# EAGLE design EYRCFINAL (EAGLE 9.6.2)
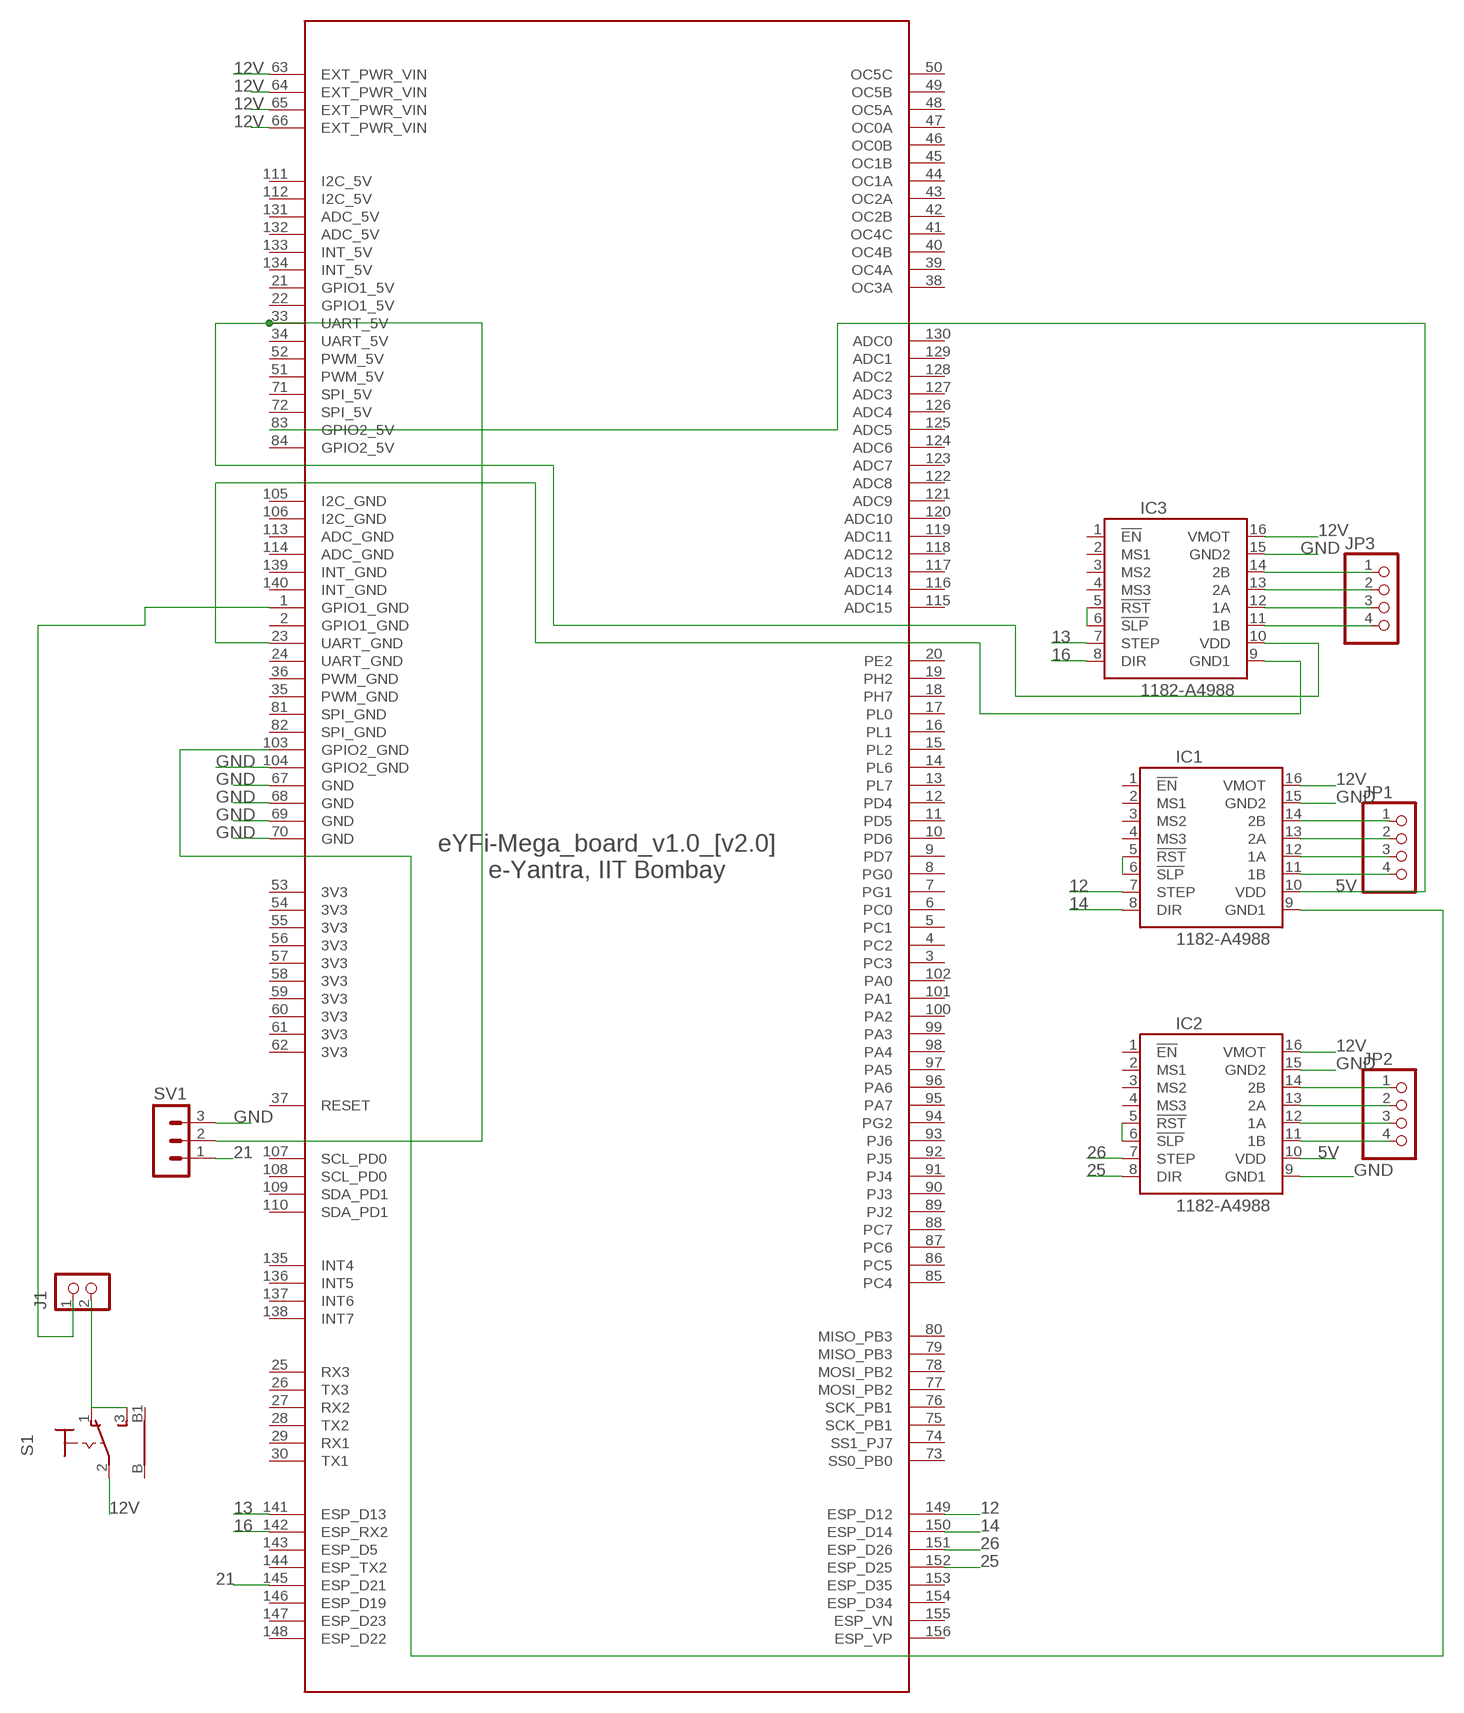
[diagram p0: schematic, sheet 1]

## Parts
IC1  1182-A4988  [A4988]
IC2  1182-A4988  [A4988]
IC3  1182-A4988  [A4988]
J1  CON_TERMINAL_BLOCK_02-5MM  [TERMINAL_BLOCK_2P_5]
JP1  PINHD-1X4  [1X04]
JP2  PINHD-1X4  [1X04]
JP3  PINHD-1X4  [1X04]
S1  9070-1W  [9070-1W]
SV1  MA03-1  [MA03-1]
U$1  EYFI-MEGA_V2.0  [EYFI-MEGA_V2.0]

## Nets
5V: IC1.10(VDD) IC2.10(VDD) U$1.83(GPIO2_5V)
12: IC1.7(STEP) U$1.149(ESP_D12)
12V: IC1.16(VMOT) IC2.16(VMOT) IC3.16(VMOT) S1.2(P) U$1.63(EXT_PWR_VIN) U$1.64(EXT_PWR_VIN) U$1.65(EXT_PWR_VIN) U$1.66(EXT_PWR_VIN)
13: IC3.7(STEP) U$1.141(ESP_D13)
14: IC1.8(DIR) U$1.150(ESP_D14)
16: IC3.8(DIR) U$1.142(ESP_RX2)
21: SV1.1 U$1.145(ESP_D21)
25: IC2.8(DIR) U$1.152(ESP_D25)
26: IC2.7(STEP) U$1.151(ESP_D26)
GND: IC1.9(GND1) IC1.15(GND2) IC2.9(GND1) IC2.15(GND2) IC3.9(GND1) IC3.15(GND2) SV1.3 U$1.23(UART_GND) U$1.67(GND) U$1.68(GND) U$1.69(GND) U$1.70(GND) U$1.103(GPIO2_GND) U$1.104(GPIO2_GND)
N$1: IC1.14(2B) JP1.1
N$2: IC1.13(2A) JP1.2
N$3: IC1.12(1A) JP1.3
N$4: IC1.11(1B) JP1.4
N$5: IC2.14(2B) JP2.1
N$6: IC2.13(2A) JP2.2
N$7: IC2.12(1A) JP2.3
N$8: IC2.11(1B) JP2.4
N$9: IC3.14(2B) JP3.1
N$10: IC3.13(2A) JP3.2
N$11: IC3.12(1A) JP3.3
N$12: IC3.11(1B) JP3.4
N$13: J1.1 U$1.1(GPIO1_GND)
N$14: IC3.10(VDD) SV1.2 U$1.33(UART_5V)
N$15: J1.2 S1.1(O) S1.3(S)
N$16: IC3.5(!RST) IC3.6(!SLP)
N$17: IC1.5(!RST) IC1.6(!SLP)
N$18: IC2.5(!RST) IC2.6(!SLP)
Unconnected: IC1.1(!EN) IC1.2(MS1) IC1.3(MS2) IC1.4(MS3) IC2.1(!EN) IC2.2(MS1) IC2.3(MS2) IC2.4(MS3) IC3.1(!EN) IC3.2(MS1) IC3.3(MS2) IC3.4(MS3) S1.B S1.B1 U$1.3(PC3) U$1.4(PC2) U$1.5(PC1) U$1.6(PC0) U$1.7(PG1) U$1.8(PG0) U$1.9(PD7) U$1.10(PD6) U$1.11(PD5) U$1.12(PD4) U$1.13(PL7) U$1.14(PL6) U$1.15(PL2) U$1.16(PL1) U$1.17(PL0) U$1.18(PH7) U$1.19(PH2) U$1.20(PE2) U$1.25(RX3) U$1.26(TX3) U$1.27(RX2) U$1.28(TX2) U$1.29(RX1) U$1.30(TX1) U$1.37(RESET) U$1.38(OC3A) U$1.39(OC4A) U$1.40(OC4B) U$1.41(OC4C) U$1.42(OC2B) U$1.43(OC2A) U$1.44(OC1A) U$1.45(OC1B) U$1.46(OC0B) U$1.47(OC0A) U$1.48(OC5A) U$1.49(OC5B) U$1.50(OC5C) U$1.73(SS0_PB0) U$1.74(SS1_PJ7) U$1.75(SCK_PB1) U$1.76(SCK_PB1) U$1.77(MOSI_PB2) U$1.78(MOSI_PB2) U$1.79(MISO_PB3) U$1.80(MISO_PB3) U$1.85(PC4) U$1.86(PC5) U$1.87(PC6) U$1.88(PC7) U$1.89(PJ2) U$1.90(PJ3) U$1.91(PJ4) U$1.92(PJ5) U$1.93(PJ6) U$1.94(PG2) U$1.95(PA7) U$1.96(PA6) U$1.97(PA5) U$1.98(PA4) U$1.99(PA3) U$1.100(PA2) U$1.101(PA1) U$1.102(PA0) U$1.107(SCL_PD0) U$1.108(SCL_PD0) U$1.109(SDA_PD1) U$1.110(SDA_PD1) U$1.115(ADC15) U$1.116(ADC14) U$1.117(ADC13) U$1.118(ADC12) U$1.119(ADC11) U$1.120(ADC10) U$1.121(ADC9) U$1.122(ADC8) U$1.123(ADC7) U$1.124(ADC6) U$1.125(ADC5) U$1.126(ADC4) U$1.127(ADC3) U$1.128(ADC2) U$1.129(ADC1) U$1.130(ADC0) U$1.135(INT4) U$1.136(INT5) U$1.137(INT6) U$1.138(INT7) U$1.143(ESP_D5) U$1.144(ESP_TX2) U$1.146(ESP_D19) U$1.147(ESP_D23) U$1.148(ESP_D22) U$1.153(ESP_D35) U$1.154(ESP_D34) U$1.155(ESP_VN) U$1.156(ESP_VP)

## Power pins joined to a net without a drawn wire
3V3: U$1.53(3V3) U$1.54(3V3) U$1.55(3V3) U$1.56(3V3) U$1.57(3V3) U$1.58(3V3) U$1.59(3V3) U$1.60(3V3) U$1.61(3V3) U$1.62(3V3)
ADC_5V: U$1.131(ADC_5V) U$1.132(ADC_5V)
ADC_GND: U$1.113(ADC_GND) U$1.114(ADC_GND)
GPIO1_5V: U$1.21(GPIO1_5V) U$1.22(GPIO1_5V)
GPIO1_GND: U$1.2(GPIO1_GND)
GPIO2_5V: U$1.84(GPIO2_5V)
I2C_5V: U$1.111(I2C_5V) U$1.112(I2C_5V)
I2C_GND: U$1.105(I2C_GND) U$1.106(I2C_GND)
INT_5V: U$1.133(INT_5V) U$1.134(INT_5V)
INT_GND: U$1.139(INT_GND) U$1.140(INT_GND)
PWM_5V: U$1.51(PWM_5V) U$1.52(PWM_5V)
PWM_GND: U$1.35(PWM_GND) U$1.36(PWM_GND)
SPI_5V: U$1.71(SPI_5V) U$1.72(SPI_5V)
SPI_GND: U$1.81(SPI_GND) U$1.82(SPI_GND)
UART_5V: U$1.34(UART_5V)
UART_GND: U$1.24(UART_GND)

## Library data of the parts
IC1-IC3 = pololu-stepper-driver:1182-A4988: A4988 Stepper Motor Driver Carrier #1182 A4988 Stepper Motor Driver Carrier <https://www.pololu.com/product/1182> in Japan, Suzaku Lab. Ltd. <https://suzakugiken.jp/> #1182 A4988ステッピングモータドライバ <https://szc.jp/po1182>
J1 = dp_devices.v6:CON_TERMINAL_BLOCK_02: 2 poles wire to board terminal block
JP1-JP3 = pinhead:PINHD-1X4: PIN HEADER
S1 = switch:9070-1W: TOGGLE SWITCH Marquardt
SV1 = con-lstb:MA03-1: PIN HEADER; OC_FARNELL: unknown; OC_NEWARK: unknown
U$1 = eYFi-Mega_board_v1.0:EYFI-MEGA_V2.0

## Board
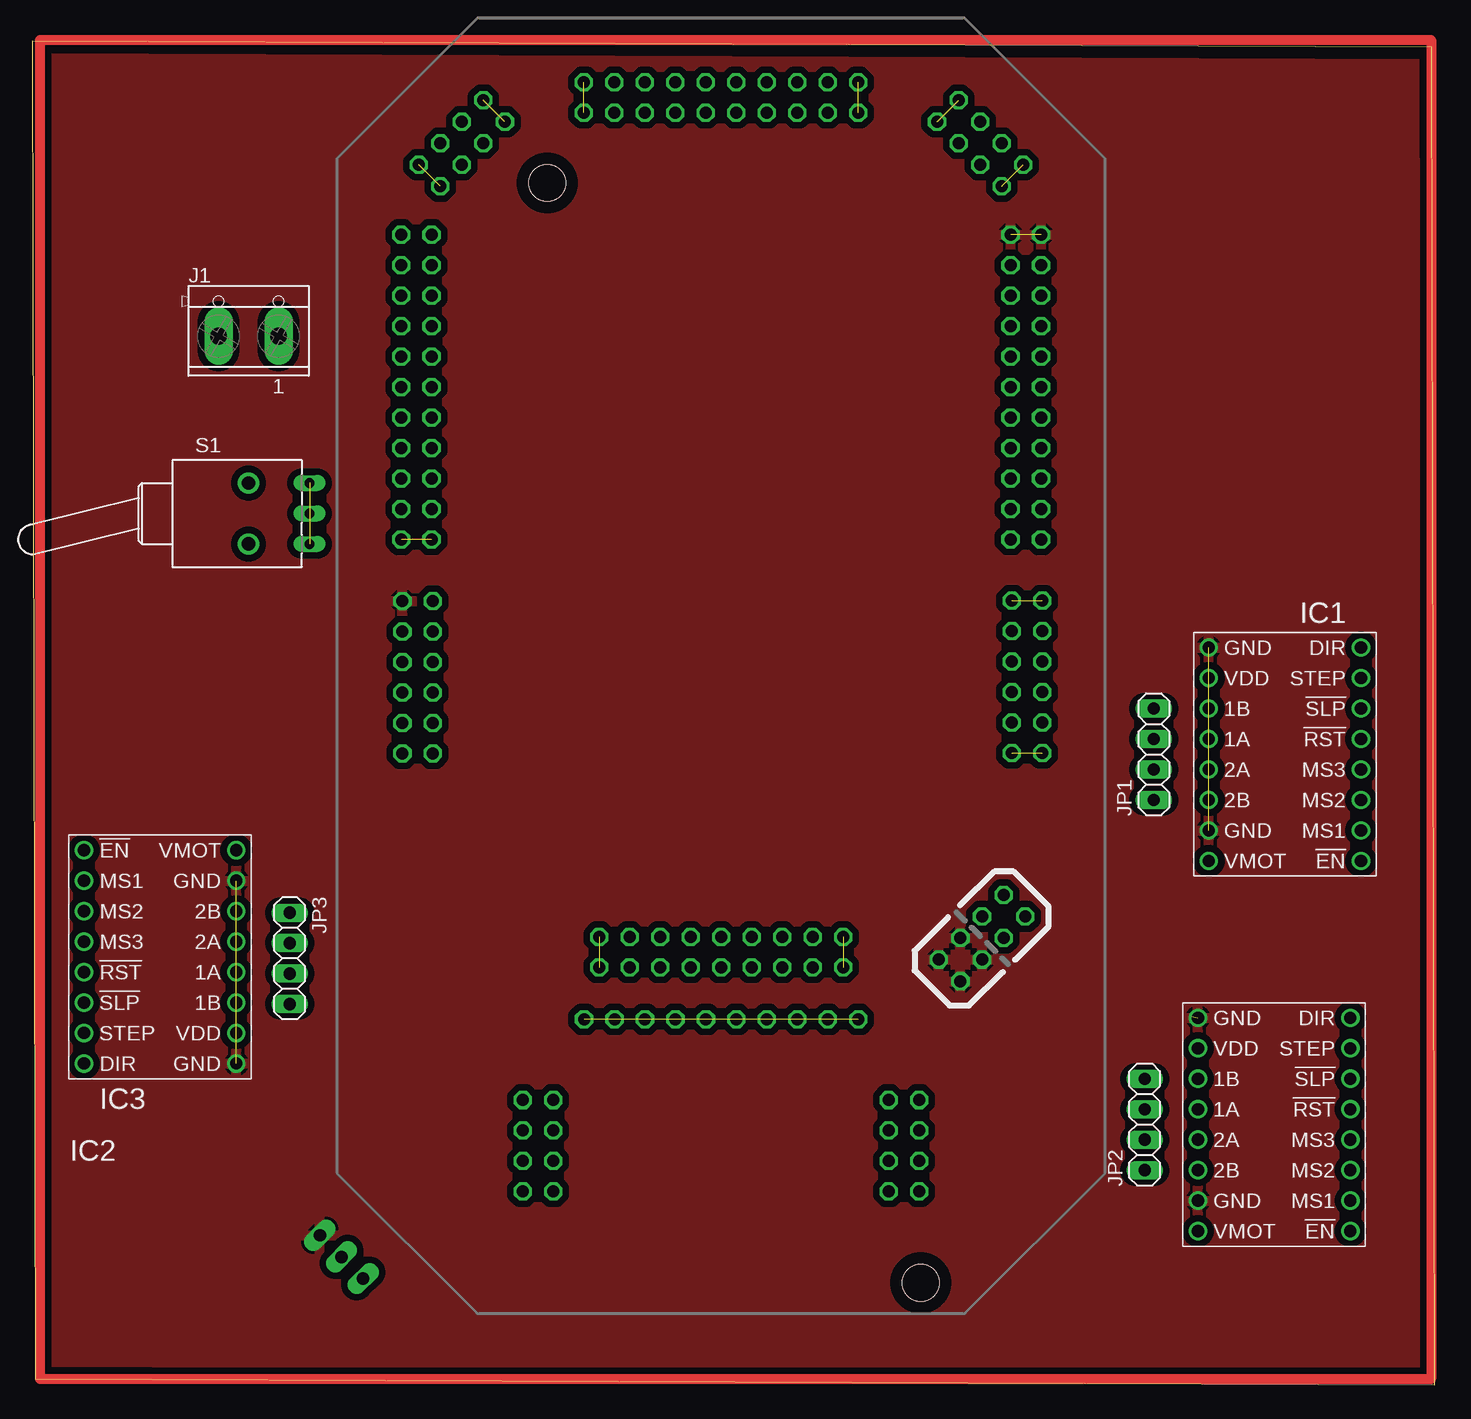
[diagram p1: board, top side]
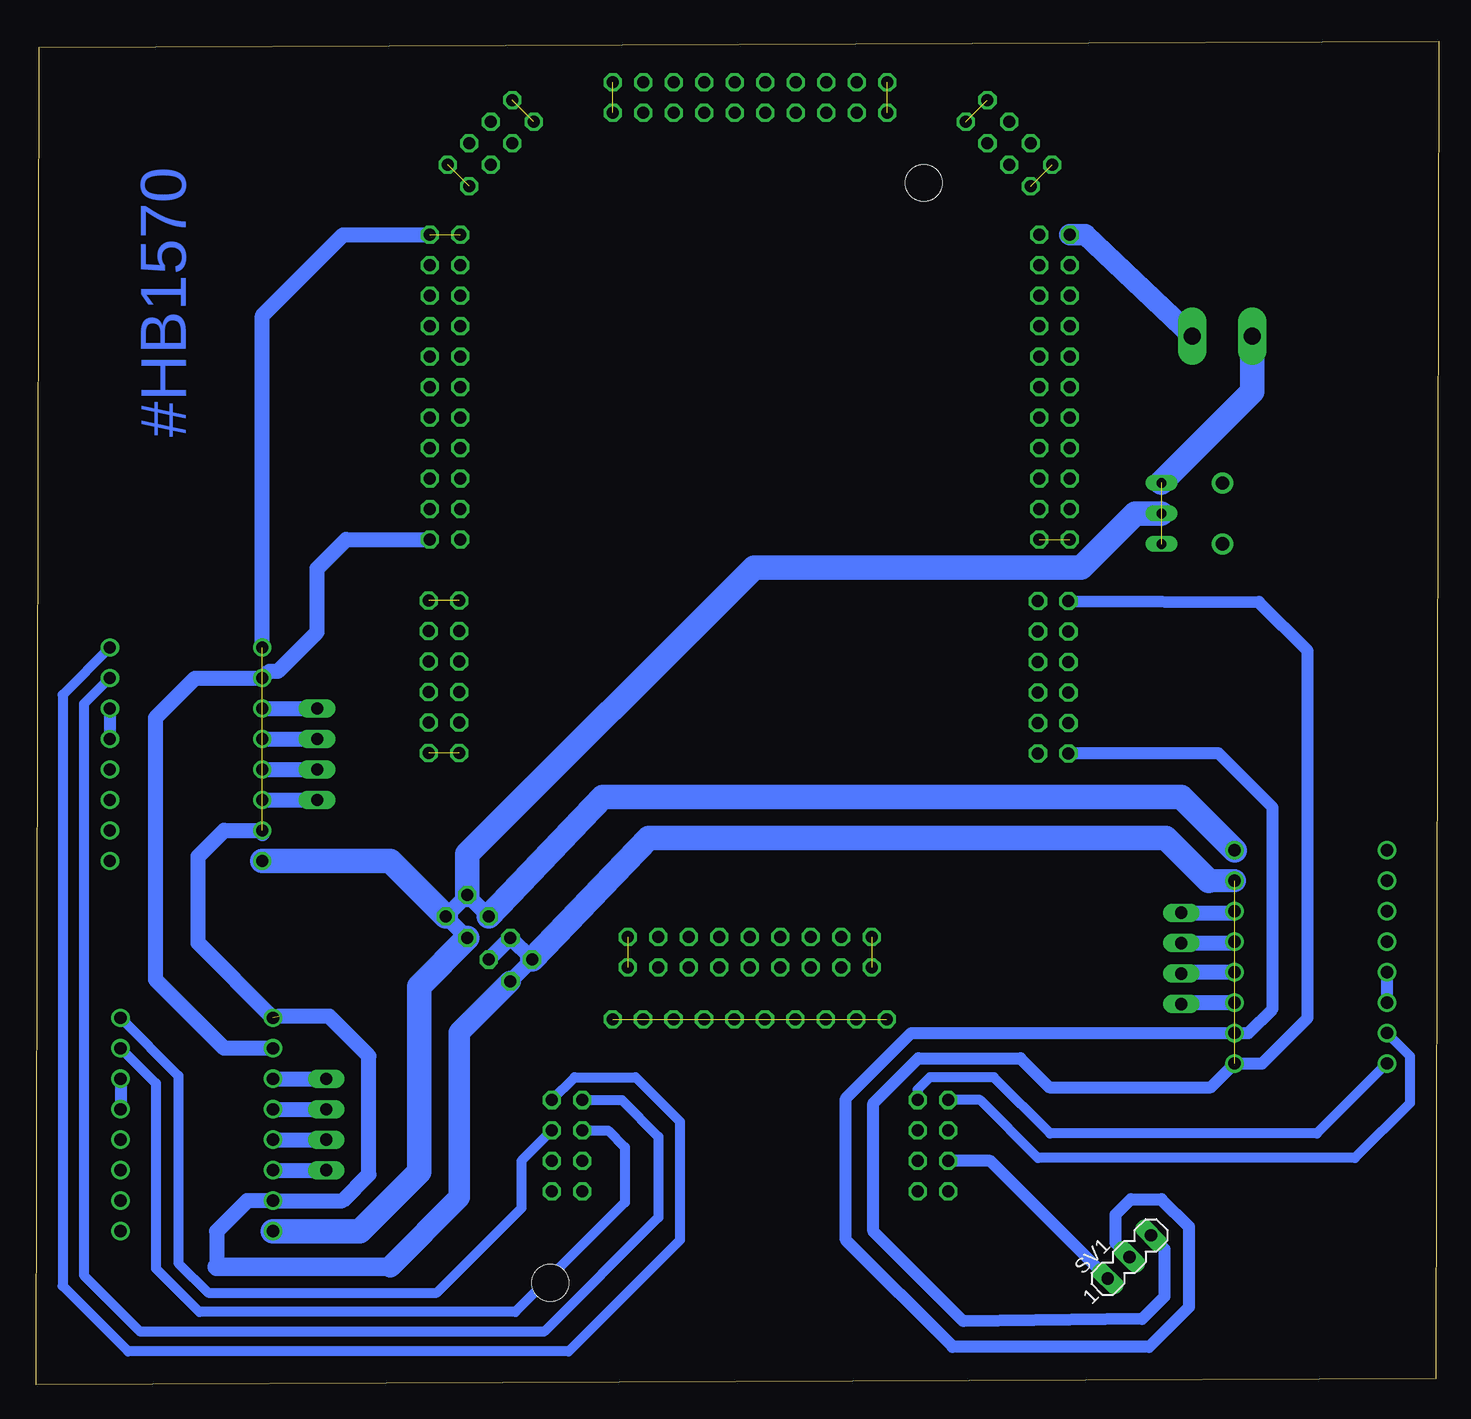
[diagram p2: board, bottom side, seen from below]

Size 116.89 x 112 mm. Coordinates in mm from the lower left corner, seen from the top.
Outline: 0.25,0.51 116.89,0 116.64,111.5 0,112 0.25,0.51
Copper layers (1*16): Top 0.035mm / dielectric 1.5mm / Bottom 0.035mm
Design rules "default *": minimum track width 6mil, minimum drill 0.35mm, track to track 22mil, track to pad 22mil, pad to pad 22mil, via to via 22mil, smd to smd 22mil, copper to edge 40mil, drill to drill 6mil, minimum pad ring 10mil, minimum via ring 8mil, stop-mask expansion 4mil, vias tented up to drill 0mil, thermal gap 10mil

### Footprints (pad centres in the part's own frame; a part is rotated, then mirrored left to right if it is on the bottom)
A4988 = drill 1.016: 1 -6.35,8.89; 2 -6.35,6.35; 3 -6.35,3.81; 4 -6.35,1.27; 5 -6.35,-1.27; 6 -6.35,-3.81; 7 -6.35,-6.35; 8 -6.35,-8.89; 9 6.35,-8.89; 10 6.35,-6.35; 11 6.35,-3.81; 12 6.35,-1.27; 13 6.35,1.27; 14 6.35,3.81; 15 6.35,6.35; 16 6.35,8.89
TERMINAL_BLOCK_2P_5 = drill 1.4 pad 2.38 long: 1 2.5,-0.45; 2 -2.5,-0.45
1X04 = drill 1.016 long: 1 -3.81,0; 2 -1.27,0; 3 1.27,0; 4 3.81,0
9070-1W = drill 0.813 long: 1 5.08,-2.54; 2 5.08,0; 3 5.08,2.54 | drill 1.118 pad 1.778: B 0,-2.54; B1 0,2.54
MA03-1 = drill 1.016 long: 1 -2.54,0; 2 0,0; 3 2.54,0
EYFI-MEGA_V2.0 = drill 1 octagon: 1 -26.66,35.941; 2 -24.12,35.941; 3 -26.66,33.401; 4 -24.12,33.401; 5 -26.66,30.861; 6 -24.12,30.861; 7 -26.66,28.321; 8 -24.12,28.321; 9 -26.66,25.781; 10 -24.12,25.781; 11 -26.66,23.241; 12 -24.12,23.241; 13 -26.66,20.701; 14 -24.12,20.701; 15 -26.66,18.161; 16 -24.12,18.161; 17 -26.66,15.621; 18 -24.12,15.621; 19 -26.66,13.081; 20 -24.12,13.081; 21 -26.66,10.541; 22 -24.12,10.541; 23 -26.543,5.397; 24 -24.003,5.397; 25 -26.543,2.857; 26 -24.003,2.857; 27 -26.543,0.318; 28 -24.003,0.318; 29 -26.543,-2.223; 30 -24.003,-2.223; 31 -26.543,-4.763; 32 -24.003,-4.763; 33 -26.543,-7.303; 34 -24.003,-7.303; 35 -10.147,-25.136; 36 -10.147,-22.596; 37 -7.607,-25.136; 38 -7.607,-22.596; 39 -5.067,-25.136; 40 -5.067,-22.596; 41 -2.527,-25.136; 42 -2.527,-22.596; 43 0.013,-25.136; 44 0.013,-22.596; 45 2.553,-25.136; 46 2.553,-22.596; 47 5.093,-25.136; 48 5.093,-22.596; 49 7.633,-25.136; 50 7.633,-22.596; 51 10.173,-25.136; 52 10.173,-22.596; 53 -11.412,-29.464; 54 -8.872,-29.464; 55 -6.332,-29.464; 56 -3.792,-29.464; 57 -1.252,-29.464; 58 1.288,-29.464; 59 3.828,-29.464; 60 6.368,-29.464; 61 8.908,-29.464; 62 11.448,-29.464; 63 25.344,-20.897; 64 23.548,-19.101; 65 23.548,-22.693; 66 21.752,-20.897; 67 21.752,-24.489; 68 19.956,-22.693; 69 19.956,-26.285; 70 18.16,-24.489; 71 26.779,-7.264; 72 24.239,-7.264; 73 26.779,-4.724; 74 24.239,-4.724; 75 26.779,-2.184; 76 24.239,-2.184; 77 26.779,0.356; 78 24.239,0.356; 79 26.779,2.896; 80 24.239,2.896; 81 26.779,5.436; 82 24.239,5.436; 83 26.67,10.541; 84 24.13,10.541; 85 26.67,13.081; 86 24.13,13.081; 87 26.67,15.621; 88 24.13,15.621; 89 26.67,18.161; 90 24.13,18.161; 91 26.67,20.701; 92 24.13,20.701; 93 26.67,23.241; 94 24.13,23.241; 95 26.67,25.781; 96 24.13,25.781; 97 26.67,28.321; 98 24.13,28.321; 99 26.67,30.861; 100 24.13,30.861; 101 26.67,33.401; 102 24.13,33.401; 103 26.67,35.941; 104 24.13,35.941; 105 25.188,41.771; 106 23.392,39.975; 107 23.392,43.567; 108 21.596,41.771; 109 21.596,45.363; 110 19.8,43.567; 111 19.8,47.16; 112 18.004,45.363; 113 11.43,48.641; 114 11.43,46.101; 115 8.89,48.641; 116 8.89,46.101; 117 6.35,48.641; 118 6.35,46.101; 119 3.81,48.641; 120 3.81,46.101; 121 1.27,48.641; 122 1.27,46.101; 123 -1.27,48.641; 124 -1.27,46.101; 125 -3.81,48.641; 126 -3.81,46.101; 127 -6.35,48.641; 128 -6.35,46.101; 129 -8.89,48.641; 130 -8.89,46.101; 131 -11.43,48.641; 132 -11.43,46.101; 133 -19.796,47.158; 134 -18,45.362; 135 -21.593,45.362; 136 -19.796,43.566; 137 -23.389,43.566; 138 -21.593,41.77; 139 -25.185,41.77; 140 -23.389,39.974; 141 -16.51,-36.195; 142 -13.97,-36.195; 143 -16.51,-38.735; 144 -13.97,-38.735; 145 -16.51,-41.275; 146 -13.97,-41.275; 147 -16.51,-43.815; 148 -13.97,-43.815; 149 13.97,-36.195; 150 16.51,-36.195; 151 13.97,-38.735; 152 16.51,-38.735; 153 13.97,-41.275; 154 16.51,-41.275; 155 13.97,-43.815; 156 16.51,-43.815 | hole 3.048: -14.478,40.259; 16.637,-51.435

### Placement (x,y rotation side)
IC1  104.39,52.58 180 top
IC2  103.5,21.72 180 top
IC3  10.67,35.69 0 top
J1  18.03,87.88 0 top
JP1  93.47,52.58 90 top
JP2  92.71,21.72 90 top
JP3  21.46,35.56 270 top
S1  18.03,72.64 0 top
SV1  25.78,10.67 45 bottom
U$1  57.4,59.94 0 top

### Tracks (layer width: path | path; a pad name or v marks a point on that pad's centre or on a via)
3V3  (9 unrouted)
5V
  Bottom 1.27: U$1.83 91.06,70.48 93.47,68.07 93.47,62.77 96.73,59.51 97.46,59.51 IC1.10 103.63,58.93 106.93,55.63 106.93,33.78 101.22,28.07 IC2.10
12
  Bottom 0.813: U$1.149 68.07,23.75 65.02,20.7 65.02,13.97 74.55,4.44 108.2,4.44 112.9,9.14 112.9,56.77 IC1.7
12V
  Bottom 1.27: U$1.65 U$1.63 U$1.64 U$1.66
  Bottom 2.032: IC3.16 21.46,49.02 69.69,49.02 U$1.66 | U$1.64 80.95,44.25 57.04,68.16 29.78,68.16 25.29,72.64 S1.2 | IC2.16 89.92,12.83 84.96,17.78 84.96,33.24 U$1.65 | U$1.63 87.39,43.69 IC1.16
13
  Bottom 0.813: U$1.141 38.23,23.75 33.4,18.92 6.98,18.92 2.41,23.5 2.41,27.43 IC3.7
14
  Bottom 0.813: U$1.150 72.01,25.65 66.93,25.65 63.25,21.97 63.25,12.06 72.52,2.79 109.22,2.79 114.68,8.25 114.68,57.53 IC1.8
16
  Bottom 0.813: IC3.8 10.16,20.95 32.38,20.95 37.08,25.65 42.42,25.65 43.43,24.64 U$1.142
21
  Bottom 1.016: SV1.1 37.37,18.67 U$1.145
25
  Bottom 0.813: U$1.152 76.45,18.67 76.45,14.73 83.49,7.7 102.56,7.7 105.03,10.16 105.03,25.78 IC2.8
26
  Bottom 0.813: IC2.7 109.82,28.07 106.91,25.15 106.91,9.72 103.29,6.1 76.94,6.1 67.82,15.22 67.82,19.81 69.22,21.21 U$1.151
ADC_5V  (1 unrouted)
ADC_GND  (1 unrouted)
GND  (4 unrouted)
  Bottom 1.016: SV1.3 22.86,11.34 22.86,7.37 24.73,5.5 39.61,5.31 47.12,12.79 47.12,23.48 43.37,27.23 34.86,27.23 32.46,24.83 18.99,24.83 IC3.9 14.73,26.8 10.92,30.61 10.92,61.21 14.99,65.28 U$1.23
  Bottom 1.27: U$1.69 U$1.70 U$1.68 U$1.67 | IC1.9 98.04,89.15 91.31,95.89 U$1.103 | 98.04,45.95 IC1.15 101.22,46.23 103.38,44.07 103.38,36.83 IC2.9 | 101.85,9.86 101.85,12.83 99.31,15.37 IC2.15 91.34,15.37 89.15,17.55 89.15,27.43 92.46,30.73 96.65,30.73
  Bottom 1.524: 101.85,9.86 87.38,9.86
  Bottom 1.778: U$1.69 81.61,29.41 81.61,15.62 87.38,9.86
  Bottom 1.905: IC3.15 19.18,42.04
  Bottom 2.032: 19.18,42.04 22.73,45.59 65.83,45.59 U$1.70
  pour Top: 0.51,112.14 116.59,112.14 116.59,0.51 0.51,0.51
GPIO1_5V  (1 unrouted)
I2C_5V  (1 unrouted)
I2C_GND  (1 unrouted)
INT_5V  (1 unrouted)
INT_GND  (1 unrouted)
N$1
  Bottom 1.27: IC1.14 JP1.1
N$2
  Bottom 1.27: IC1.13 JP1.2
N$3
  Bottom 1.27: IC1.12 JP1.3
N$4
  Bottom 1.27: IC1.11 JP1.4
N$5
  Bottom 1.27: IC2.14 JP2.1
N$6
  Bottom 1.27: IC2.13 JP2.2
N$7
  Bottom 1.27: IC2.12 JP2.3
N$8
  Bottom 1.27: IC2.11 JP2.4
N$9
  Bottom 1.27: 21.34,39.5 JP3.1 17.14,39.37 IC3.14
N$10
  Bottom 1.27: 21.34,36.96 JP3.2 17.14,36.83 IC3.13
N$11
  Bottom 1.27: JP3.3 21.34,34.42 IC3.12
N$12
  Bottom 1.27: JP3.4 21.34,31.88 IC3.11
N$13
  Bottom 1.778: U$1.1 29.47,95.89 J1.1
N$14
  Bottom 1.016: U$1.33 18.35,52.64 13.84,48.13 13.84,31.37 15.88,29.34 IC3.10 43.94,29.34 49.4,23.88 49.4,12.06 40.51,3.17 24.13,3.17 20.83,6.48 20.83,13.21 23.11,15.49 25.65,15.49 26.92,14.22 26.92,11.81 SV1.2
N$15  (2 unrouted)
  Bottom 2.032: J1.2 15.53,82.81 23.11,75.23
N$16
  Bottom 1.016: IC3.5 IC3.6
N$17
  Bottom 1.016: IC1.6 IC1.5
N$18
  Bottom 1.016: IC2.6 IC2.5
N$19
  Top 0.813: 0.63,112.14 116.59,112.14 116.59,0.51 0.63,0.51 0.63,57.4 0.63,112.14
PWM_5V  (1 unrouted)
PWM_GND  (1 unrouted)
SPI_5V  (1 unrouted)
SPI_GND  (1 unrouted)

### Text on the board
Bottom: #HB1570